# Altium project BMW E34 Start-Stop Btn v2.PrjPcb
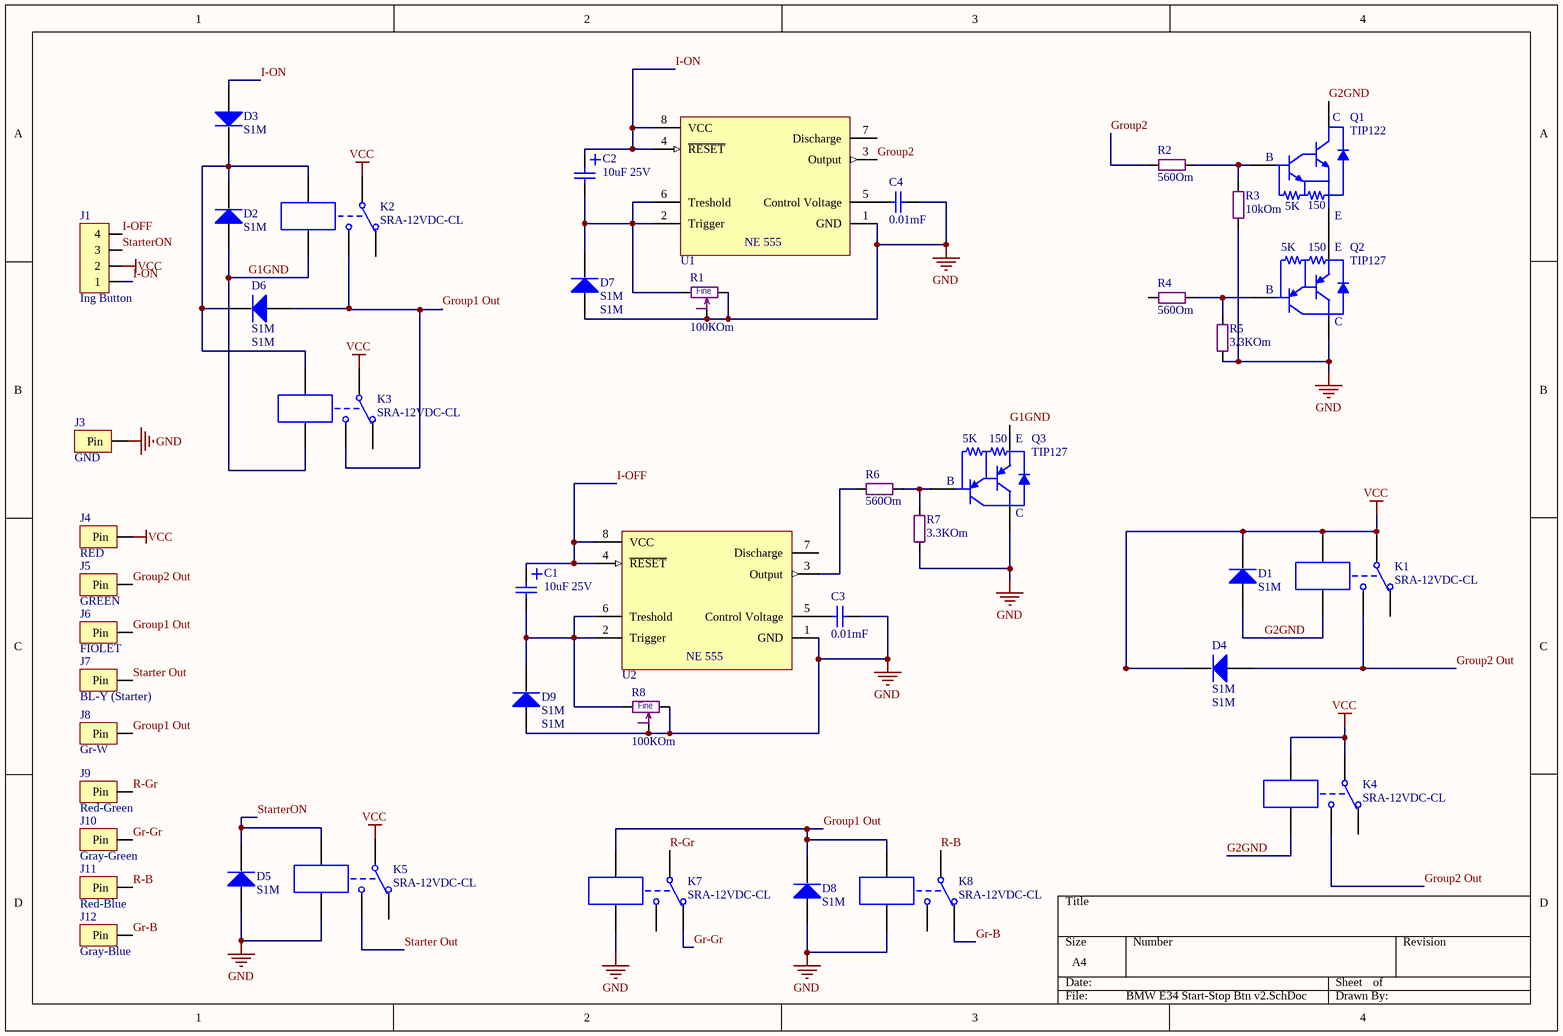
[diagram p0: BMW E34 Start-Stop Btn v2.SchDoc]
1 sheet, 44 parts. Net scope: global (net labels, ports and power ports of the same name join across sheets).
Board file: BMW E34 Start-Stop Btn v2.PcbDoc

## Sheet BMW E34 Start-Stop Btn v2.SchDoc
size A4

### Parts
C1  10uF 25V  [Cap E p2mm D6.5xH11]
C2  10uF 25V  [Cap E p2mm D6.5xH11]
C3  0.01mF  [Cap p2.54mm (2p)]
C4  0.01mF  [Cap p2.54mm (2p)]
D1  S1M  [DO-214AC]
D2  S1M  [DO-214AC]
D3  S1M  [DO-214AC]
D4  S1M  [DO-214AC]
D5  S1M  [DO-214AC]
D6  S1M  [DO-214AC]
D7  S1M  [DO-214AC]
D8  S1M  [DO-214AC]
D9  S1M  [DO-214AC]
J1  Ing Button  [Molex Micro-Fit 3.0 - 4 pin D R]
J3  GND  [OnePin 1.2x3]
J4  RED  [OnePin 1.5x4]
J5  GREEN  [OnePin 1.5x4]
J6  FIOLET  [OnePin 1.5x4]
J7  BL-Y (Starter)  [OnePin 1.5x4]
J8  Gr-W  [OnePin 1x2.5]
J9  Red-Green  [OnePin 1x2.5]
J10  Gray-Green  [OnePin 1x2.5]
J11  Red-Blue  [OnePin 1x2.5]
J12  Gray-Blue  [OnePin 1x2.5]
K1  SRA-12VDC-CL  [SRA-12VDC-CL]
K2  SRA-12VDC-CL  [SRA-12VDC-CL]
K3  SRA-12VDC-CL  [SRA-12VDC-CL]
K4  SRA-12VDC-CL  [SRA-12VDC-CL]
K5  SRA-12VDC-CL  [SRA-12VDC-CL]
K7  SRA-12VDC-CL  [SRA-12VDC-CL]
K8  SRA-12VDC-CL  [SRA-12VDC-CL]
Q1  TIP122  [TO220-2]
Q2  TIP127  [TO220-2]
Q3  TIP127  [TO220-2]
R1  100КOm  [Res Adj 3362P]
R2  560Om  [SMD 0805 (2012)]
R3  10kOm  [SMD 0805 (2012)]
R4  560Om  [SMD 0805 (2012)]
R5  3.3KOm  [SMD 0805 (2012)]
R6  560Om  [SMD 0805 (2012)]
R7  3.3KOm  [SMD 0805 (2012)]
R8  100КOm  [Res Adj 3362P]
U1  NE555  [DIP-8]  (value not drawn)
U2  NE555  [DIP-8]  (value not drawn)

### Nets
GND: C3.2 C4.2 D5.A D7.A D8.A D9.A J3.1(Pin) K5.5 K7.5 K8.5 Q2.2(C) Q3.2(C) R1.2 R1.3 R3.1 R5.1 R7.1 R8.2 R8.3 U1.1(GND) U2.1(GND)
VCC: D1.K D4.K J1.2 J4.1(Pin) K1.2 K1.4 K2.2 K3.2 K4.2 K4.4 K5.2
G1GND: D2.A K2.5 K3.5 Q3.3(E)
G2GND: D1.A K1.5 K4.5 Q1.2(C)
Gr-B: J12.1(Pin) K8.1
Gr-Gr: J10.1(Pin) K7.1
Group1 Out: D6.A D8.K J6.1(Pin) J8.1(Pin) K2.3 K3.3 K7.4 K8.4
Group2: R2.1 U1.3(Output)
Group2 Out: D4.A J5.1(Pin) K1.3 K4.3
I-OFF: C1.1 J1.4 U2.4(~{RESET}) U2.8(VCC)
I-ON: C2.1 D3.A J1.1 U1.4(~{RESET}) U1.8(VCC)
R-B: J11.1(Pin) K8.2
R-Gr: J9.1(Pin) K7.2
Starter Out: J7.1(Pin) K5.3
StarterON: D5.K J1.3 K5.4
NetC1_2: C1.2 D9.K R8.1 U2.2(Trigger) U2.6(Treshold)
NetC2_2: C2.2 D7.K R1.1 U1.2(Trigger) U1.6(Treshold)
NetC3_1: C3.1 U2.5(Control_Voltage)
NetC4_1: C4.1 U1.5(Control_Voltage)
NetD2_K: D2.K D3.K D6.K K2.4 K3.4
NetQ1_1: Q1.1(B) R2.2 R3.2
NetQ1_3: Q1.3(E) Q2.3(E)
NetQ2_1: Q2.1(B) R4.2 R5.2
NetQ3_1: Q3.1(B) R6.2 R7.2
NetR6_1: R6.1 U2.3(Output)

Not connected (* = marked no-connect by the designer): K1 1; K2 1; K3 1; K4 1; K5 1; K7 3; K8 3; R4 1; U1 7(Discharge); U2 7(Discharge)

### Notes on the sheet
- (in symbol NE555) NE 555
- (in symbol Res Adj 3362) Fine
- (in symbol TIP122) 5K; 150
- (in symbol TIP127) 5K; 150

### Library data of the parts
C1 C2 = Cap E 220mF x 16V: Capacitor; Value: 220mF 16v
C3 C4 = Cap Ceramic: Capacitor
D1-D9 = Diode S1M: 1 Amp General Purpose Rectifier; Maximum Repetitive Reverse Voltage: 1000V; IF(AV) Average Rectified Forward Current: 1A; PackageReference: DO-214AC; VALUE: S1M
J1 = Micro-Fit 4R (2x2): Horisontal, Dbl line, Male - 3mm; Part Number: 0430450402; Name: Micro-Fit 3.0; URL: http://www.molex.com/molex/products/datasheet.jsp?part=active/0430450402_PCB_HEADERS.xml
J3-J12 = OnePin Connector: Only pad
K1-K5 K7 K8 = SRA-12VDC-CL: Single-Pole Dual-Throw Relay; R обм: 240 Om; I (DC = 30 V): 10A; I (AC = 240 V): 15-20A; U: 12 V; Name: SRA-12VDC-CL; DataSheet: http://tec.org.ru/_bd/12/1208_SRA.pdf
Q1 = TIP122: NPN Darlington 5A, 65W, 100V, h>1000; I imp: 8A; h21e: >1000; Code_JEDEC: TO-220; U max: 100V; I max: 5A; P max: 65W; Channnel: NPN
Q2 Q3 = TIP127: PNP Darlington Bipolar Transistor; U max: 100V; I max: 5A; I imp: 8A; h21e: >1000; P max: 65W; Code_JEDEC: TO-220; Channnel: PNP
R1 R8 = Res Adj 3362
R2-R7 = Res All Types
U1 U2 = NE555: 8-Bit Shift Register with 3-State Output Registers; PackageDescription: DIP; 8 Leads; Row Spacing 7.62 mm; Pitch 2.54 mm / SO-8; Code_JEDEC: MS-001-BB; ComponentLink1Description: TI / STI; ComponentLink1URL: http://www.ti.com/; ComponentLink2Description: Datasheet; ComponentLink2URL: http://tec.org.ru/_bd/1/150_NE555-stm.pdf